# Altium schematic sheet NVME.SchDoc
size C; SheetNumber: 6; SheetTotal: 17
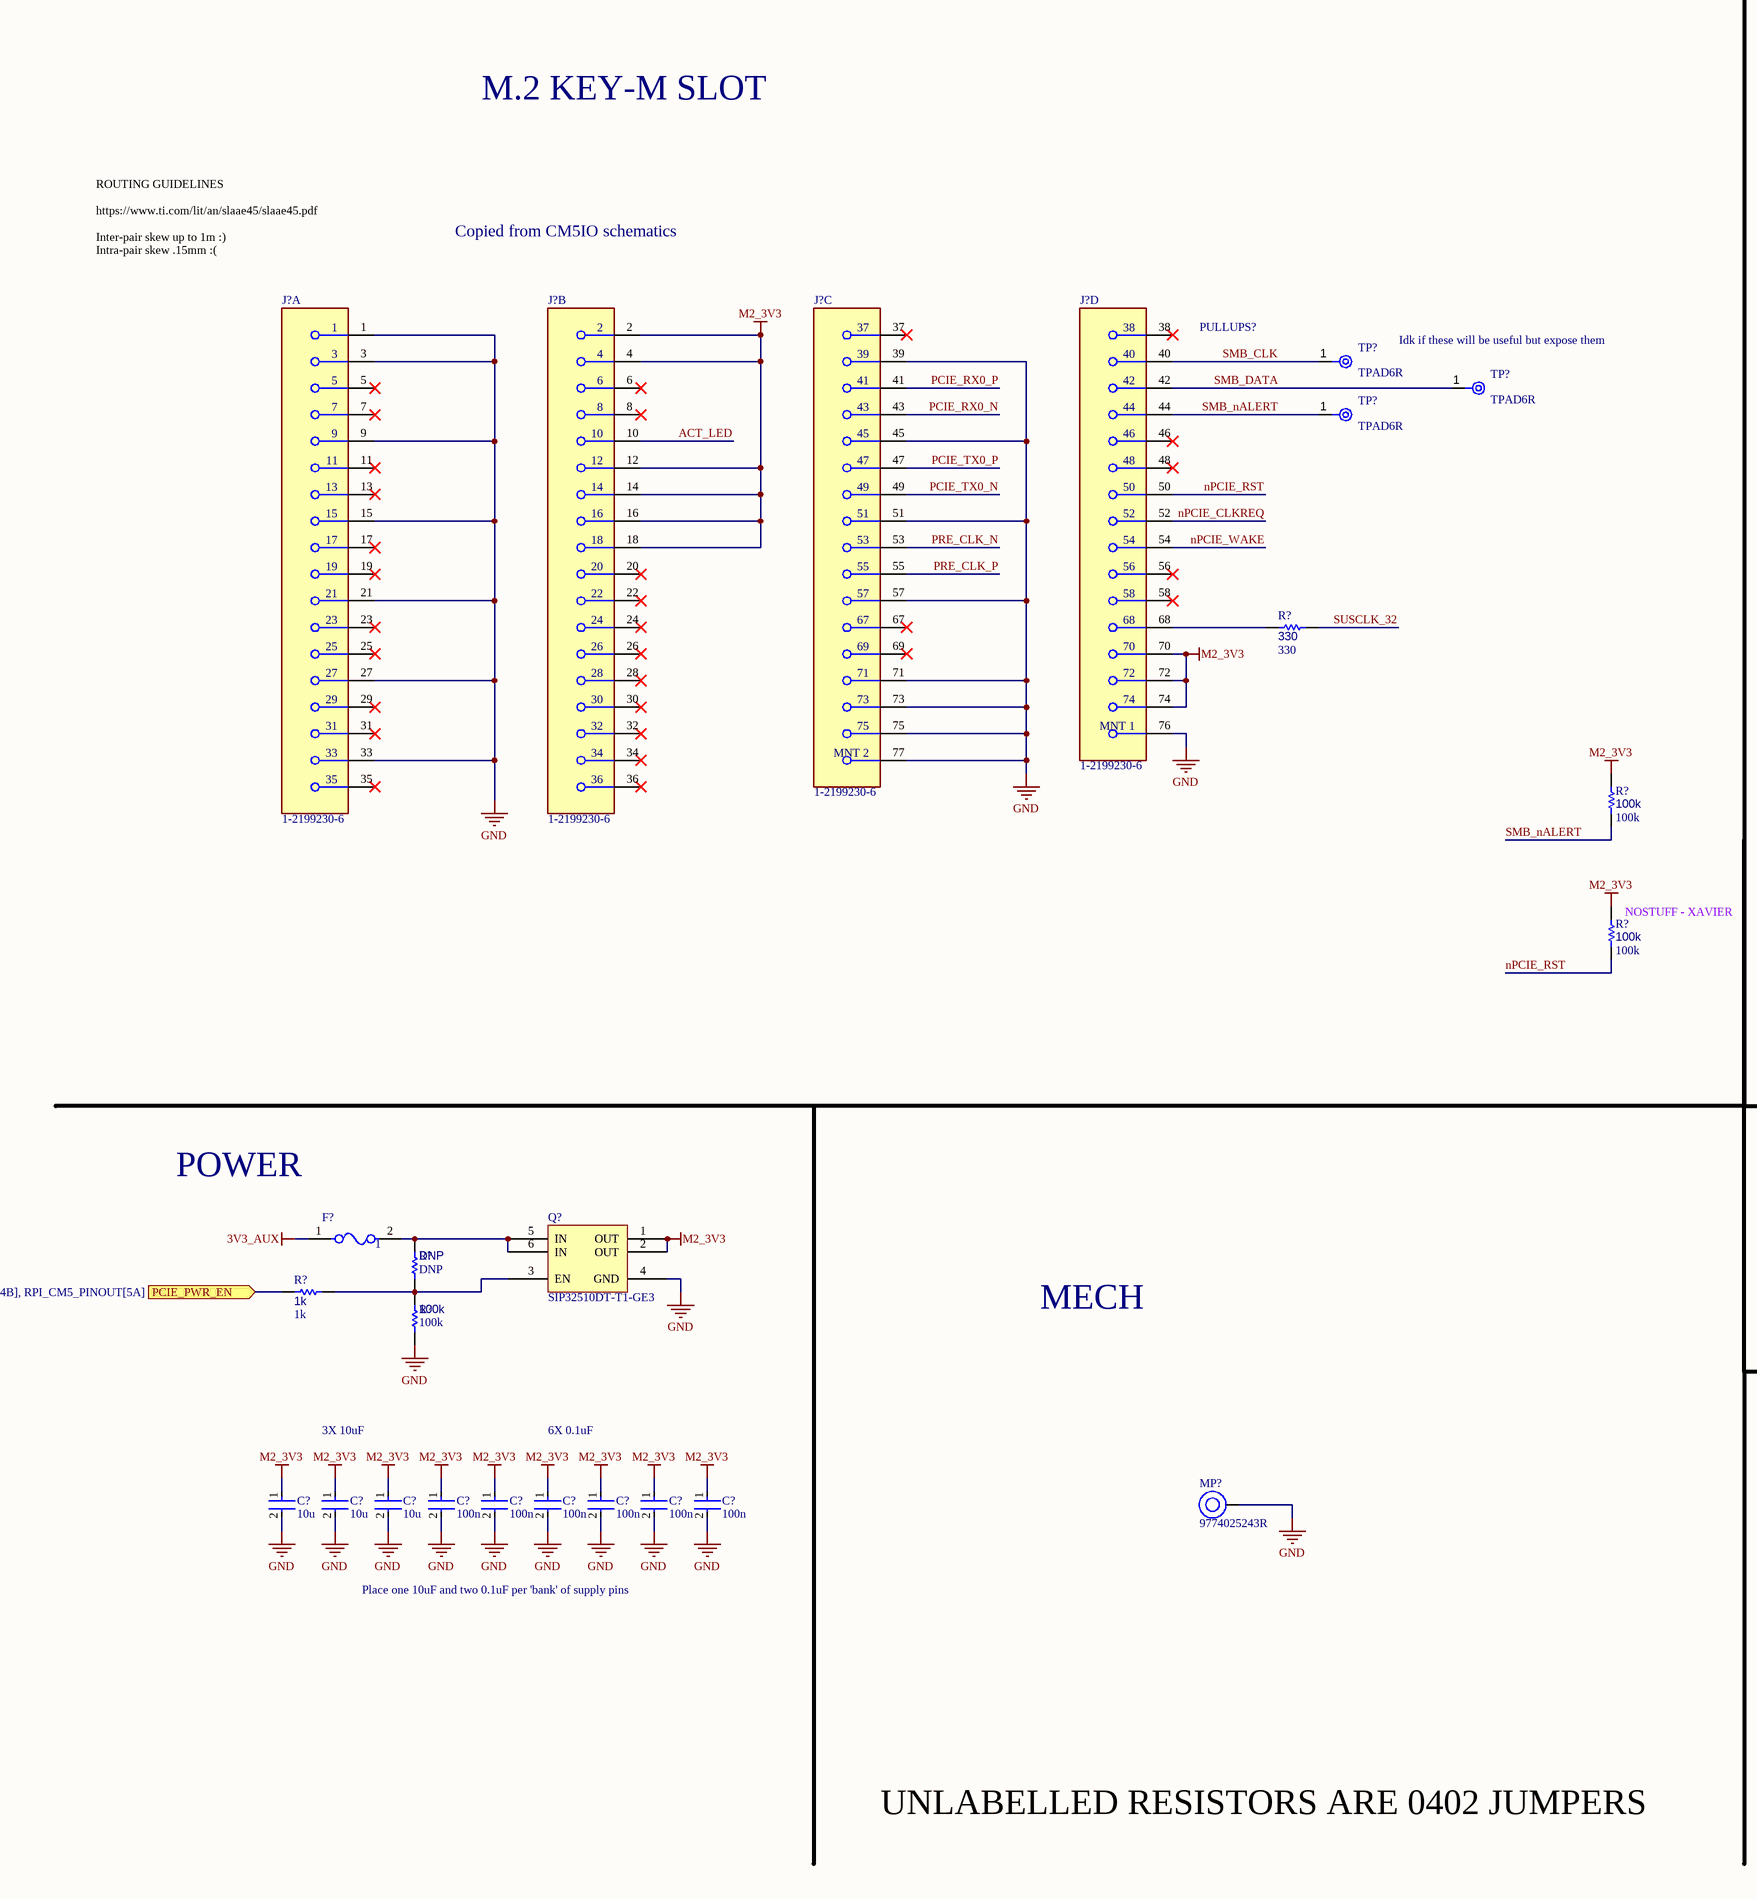
[diagram p0: NVME.SchDoc, left]
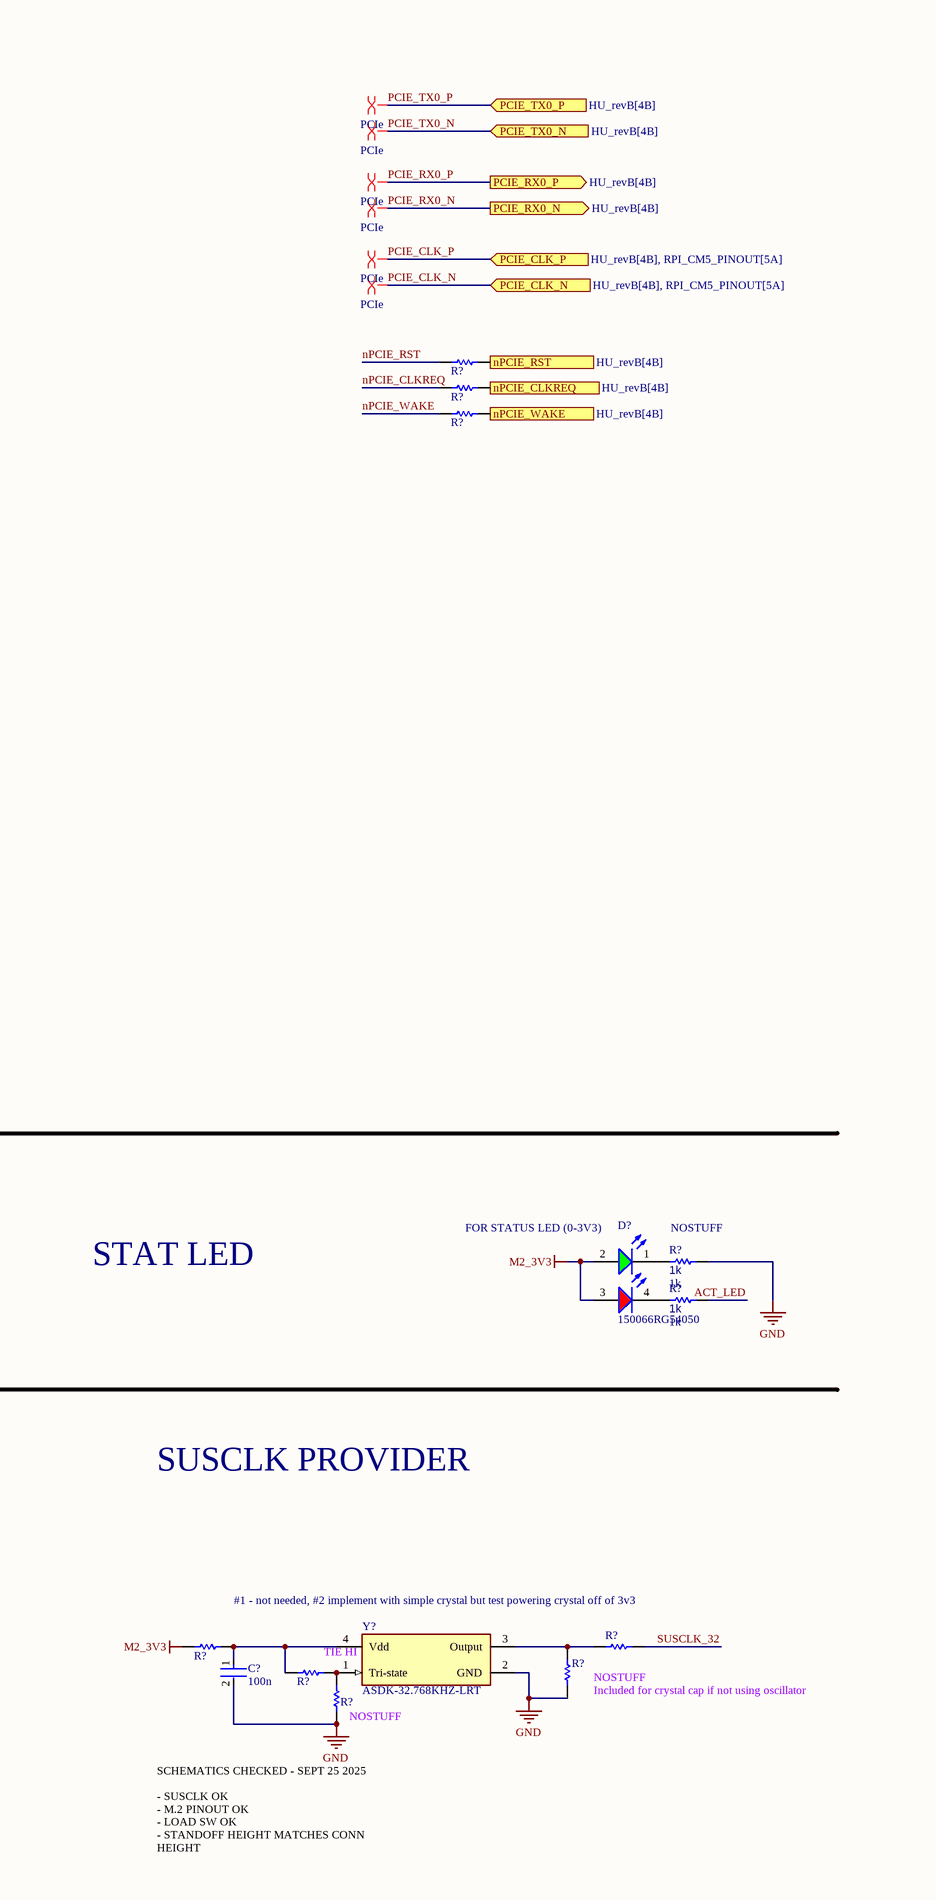
[diagram p1: NVME.SchDoc, right]

## Parts
(Parts that share a designator on the sheet are numbered #1, #2 ... from top to bottom, then left to right.)
C?#1  10u  [FP-0402-L_1_0_0_05-W_0_5-IPC_A]
C?#2  10u  [FP-0402-L_1_0_0_05-W_0_5-IPC_A]
C?#3  10u  [FP-0402-L_1_0_0_05-W_0_5-IPC_A]
C?#4  100n  [FP-0402-L_1_0_0_05-W_0_5-IPC_A]
C?#5  100n  [FP-0402-L_1_0_0_05-W_0_5-IPC_A]
C?#6  100n  [FP-0402-L_1_0_0_05-W_0_5-IPC_A]
C?#7  100n  [FP-0402-L_1_0_0_05-W_0_5-IPC_A]
C?#8  100n  [FP-0402-L_1_0_0_05-W_0_5-IPC_A]
C?#9  100n  [FP-0402-L_1_0_0_05-W_0_5-IPC_A]
C?#10  100n  [FP-0402-L_1_0_0_05-W_0_5-IPC_A]
D?  150066RG54050  [WL-SBCD_0606]
F?  1  [FP-0685T-MFG]
J?#1  1-2199230-6  [FP-1-2199230-6-MFG]  (part A of 4)
J?#2  1-2199230-6  [FP-1-2199230-6-MFG]  (part B of 4)
J?#3  1-2199230-6  [FP-1-2199230-6-MFG]  (part C of 4)
J?#4  1-2199230-6  [FP-1-2199230-6-MFG]  (part D of 4)
MP?  9774025243R  [9774025243]
Q?  SIP32510DT-T1-GE3  [SOT95P284X110-6N]
R?#1  0402 JUMPER  [RESC1005X40X25ML05T05]  (value not drawn)
R?#2  0402 JUMPER  [RESC1005X40X25ML05T05]  (value not drawn)
R?#3  0402 JUMPER  [RESC1005X40X25ML05T05]  (value not drawn)
R?#4  330  [R0603B]
R?#5  100k  [R0603B]
R?#6  100k  [R0603B]
R?#7  1k  [R0603B]
R?#8  DNP  [R0603B]
R?#9  1k  [R0603B]
R?#10  1k  [R0603B]
R?#11  100k  [R0603B]
R?#12  0402 JUMPER  [RESC1005X40X25ML05T05]  (value not drawn)
R?#13  0402 JUMPER  [RESC1005X40X25ML05T05]  (value not drawn)
R?#14  0402 JUMPER  [RESC1005X40X25ML05T05]  (value not drawn)
R?#15  0402 JUMPER  [RESC1005X40X25ML05T05]  (value not drawn)
R?#16  0402 JUMPER  [RESC1005X40X25ML05T05]  (value not drawn)
TP?#1  TPAD6R  [New footprint 1]
TP?#2  TPAD6R  [New footprint 1]
TP?#3  TPAD6R  [New footprint 1]
Y?  ASDK-32.768KHZ-LRT  [FP-ASDK-MFG]

## Ports
nPCIE_CLKREQ (out, see HU_revB[4B]), nPCIE_RST (in, see HU_revB[4B]), nPCIE_WAKE (out, see HU_revB[4B]), PCIE_CLK_N (in, see HU_revB[4B], RPI_CM5_PINOUT[5A]), PCIE_CLK_P (in, see HU_revB[4B], RPI_CM5_PINOUT[5A]), PCIE_PWR_EN (in, see HU_revB[4B], RPI_CM5_PINOUT[5A]), PCIE_RX0_N (out, see HU_revB[4B]), PCIE_RX0_P (out, see HU_revB[4B]), PCIE_TX0_N (in, see HU_revB[4B]), PCIE_TX0_P (in, see HU_revB[4B])

## Nets
3V3_AUX: F?.1
GND: C?#1.2 C?#2.2 C?#3.2 C?#4.2 C?#5.2 C?#6.2 C?#7.2 C?#8.2 C?#9.2 C?#10.2 J?#1.1 J?#1.3 J?#1.9 J?#1.15 J?#1.21 J?#1.27 J?#1.33 J?#3.39 J?#3.45 J?#3.51 J?#3.57 J?#3.71 J?#3.73 J?#3.75 J?#3.77(MNT_2) J?#4.76(MNT_1) MP?.1 Q?.4(GND) R?#7.2 R?#11.1 R?#15.1 R?#16.1 Y?.2(GND)
M2_3V3: C?#1.1 C?#2.1 C?#3.1 C?#4.1 C?#5.1 C?#6.1 C?#7.1 C?#8.1 C?#9.1 D?.2(A) D?.3(A) J?#2.2 J?#2.4 J?#2.12 J?#2.14 J?#2.16 J?#2.18 J?#4.70 J?#4.72 J?#4.74 Q?.1(OUT) Q?.2(OUT) R?#5.1 R?#6.1 R?#12.1
ACT_LED: J?#2.10 R?#9.2
nPCIE_CLKREQ: J?#4.52 R?#2.1
nPCIE_CLKREQ: R?#2.2 ; port nPCIE_CLKREQ  [a separate net that carries the same name]
nPCIE_RST: J?#4.50 R?#1.1 R?#6.2
nPCIE_RST: R?#1.2 ; port nPCIE_RST  [a separate net that carries the same name]
nPCIE_WAKE: J?#4.54 R?#3.1
nPCIE_WAKE: R?#3.2 ; port nPCIE_WAKE  [a separate net that carries the same name]
PCIE_CLK_N: port PCIE_CLK_N
PCIE_CLK_P: port PCIE_CLK_P
PCIE_PWR_EN: R?#10.2 ; port PCIE_PWR_EN
PCIE_RX0_N: J?#3.43 ; port PCIE_RX0_N
PCIE_RX0_P: J?#3.41 ; port PCIE_RX0_P
PCIE_TX0_N: J?#3.49 ; port PCIE_TX0_N
PCIE_TX0_P: J?#3.47 ; port PCIE_TX0_P
PRE_CLK_N: J?#3.53
PRE_CLK_P: J?#3.55
SMB_CLK: J?#4.40 TP?#1.1(TP)
SMB_DATA: J?#4.42 TP?#2.1(TP)
SMB_nALERT: J?#4.44 R?#5.2 TP?#3.1(TP)
SUSCLK_32: R?#4.1 R?#14.1
NetC?#10_1: C?#10.1 R?#12.2 R?#13.1 Y?.4(Vdd)
NetD?_1: D?.1(K) R?#7.1
NetD?_4: D?.4(K) R?#9.1
NetF?_2: F?.2 Q?.5(IN) Q?.6(IN) R?#8.2
NetJ?#4_68: J?#4.68 R?#4.2
NetQ?_3: Q?.3(EN) R?#8.1 R?#10.1 R?#11.2
NetR?#13_2: R?#13.2 R?#16.2 Y?.1(Tri-state)
NetR?#14_2: R?#14.2 R?#15.2 Y?.3(Output)

Not connected (* = marked no-connect by the designer): J?#1 5* 7* 11* 13* 17* 19* 23* 25* 29* 31* 35*; J?#2 6* 8* 20* 22* 24* 26* 28* 30* 32* 34* 36*; J?#3 37* 67* 69*; J?#4 38* 46* 48* 56* 58*

## Layout directives
differential pair; differential pair class PCIe: PCIE_CLK_N, PCIE_CLK_P, PCIE_RX0_N, PCIE_RX0_P, PCIE_TX0_N, PCIE_TX0_P

## Notes on the sheet
- M.2 KEY-M SLOT
- ROUTING GUIDELINES
  https://www.ti.com/lit/an/slaae45/slaae45.pdf
  Inter-pair skew up to 1m :)
  Intra-pair skew .15mm :(
- Copied from CM5IO schematics
- PULLUPS?
- (near TP?#2) Idk if these will be useful but expose them
- (near R?#6) NOSTUFF - XAVIER
- POWER
- STAT LED
- (near D?) FOR STATUS LED (0-3V3)
- (near R?#7) NOSTUFF
- MECH
- 3X 10uF
- 6X 0.1uF
- SUSCLK PROVIDER
- Place one 10uF and two 0.1uF per 'bank' of supply pins
- #1 - not needed, #2 implement with simple crystal but test powering crystal off of 3v3
- (near Y?) TIE HI
- (near R?#16) NOSTUFF
- (near R?#15) NOSTUFF
- (near R?#15) Included for crystal cap if not using oscillator
- UNLABELLED RESISTORS ARE 0402 JUMPERS
- SCHEMATICS CHECKED - SEPT 25 2025
  - SUSCLK OK
  - M.2 PINOUT OK
  - LOAD SW OK
  - STANDOFF HEIGHT MATCHES CONN HEIGHT

## Library data of the parts
C?#1-C?#10 = CMP-001-00058-1: LARGE PADS, 0402 CAP, CHANGE COMMENT TO MATCH REAL P/N; Capacitor Type: Ceramic; Min Operating Temperature: -55°C; Mounting Technology: Surface Mount; Pins: 2; Case/Package: 0402; RoHS Compliant: Yes; Max Operating Temperature: 85°C
D? = CMP-004-00040-2: Led, Red/Grn, 180Mcd/230Mcd, 624Nm/525Nm Rohs Compliant: Yes; Source: rgled.SchLib; Component Type: Standard; Pins: 4; Design Item ID: CMP-004-00034-2
F? = CMP-16042-000006-1: FUSE BOARD MNT 5A 63VAC/VDC 1206; RoHS Compliant: Yes
J?#1-J?#4 = CMP-03365-000001-1: CONN EDGE DUAL FMALE 67POS 0.020; Manufacturer: TE; Number Of Contacts: 67; Current Rating: 0.5A; Pitch: 0.5mm; Conn Gender: Female; Is Female: yes; Voltage Rating: 50V; Conn Orientation: Right Angle; Automotive: No; Temperature Range High: +80°C; Package: 1-2199230-6; Category: Conn; Temperature: -40°C to +80°C; Number Of Rows: 2; ComponentLink2URL: http://www.te.com/commerce/DocumentDelivery/DDEController?Action=showdoc&DocId=Specification+Or+Standard%7F114-115006%7FB%7Fpdf%7FEnglish%7FENG_SS_114-115006_B_114-115006_REV_B.pdf%7F1-2199230-6; Manufacturer Part Number: 1-2199230-6; Height: 4.2mm; RoHS: TRUE; Footprint Url: http://www.te.com/commerce/DocumentDelivery/DDEController?Action=showdoc&DocId=Customer+Drawing%7F2199230%7FB2%7Fpdf%7FEnglish%7FENG_CD_2199230_B2.pdf%7F1-2199230-6; Digikey Description: CONN EDGE DUAL FMALE 67POS 0.020; Device Class L2: Card Edge Connectors; Contact Material: Gold,Tin; Device Class L1: Connectors; Device Class L3: unset; ComponentLink2Description: Datasheet; Temperature Range Low: -40°C; Octopart: https://octopart.com/1-2199230-6-te+connectivity-34969376; Lead Free: Yes
MP? = CMP-03913-59774857-1: 9774025243R Spacer Material: Steel, Tin-Plated Mounting: SMT Series: WA-SMST Thread D: M2; Outside Diameter: 4.3434mm; Threaded/Unthreaded: Threaded; Plating: Tin; REACH SVHC: Unknown; NexarPartId: 59774857; RoHS: Compliant; Material: Steel; Packaging: Tape and Reel; Max Operating Temperature: 150°C; Min Operating Temperature: -55°C; Length: 2.5mm; Height: 2.5mm
Q? = CMP-019-00054-1: Power Switch ICs – Power Distribution; VISHAY; SIP32510DT-T1-GE3; 1; 1; 5.5 V; SOT-23-6; Max Supply Voltage: 5.5V; Max Power Dissipation: 833mW; Min Supply Voltage: 1.2V; Case/Package: SOT-23-6; Mounting Technology: Surface Mount; Max Operating Temperature: 85°C; Min Operating Temperature: -40°C
R?#1-R?#3 R?#12-R?#16 = CMP-009-00118-2: READ THE NAME; Pins: 2; Component Type: Standard; Design Item ID: CMP-009-00206-2; Source: 0402jump.SchLib
R?#4-R?#11 = CMP-009-00002-14: Resistor
  R?#4: Value: 330
  R?#5 R?#6 R?#11: Value: 100k
  R?#7 R?#9 R?#10: Value: 1k
  R?#8: Value: DNP
TP?#1-TP?#3 = CMP-00025-2: Test Point .6mm
Y? = CMP-27762-001115-1: XTAL OSC XO 32.7680KHZ CMOS SMD; Load Capacitance: 15pF; Max Supply Current: 3.5mA; Min Supply Voltage: 2.97V; Operating Supply Voltage: 3.3V; Frequency Stability: 25ppm; Lead Free: Lead Free; Case/Package: CSMD; Number of Pins: 4; Max Operating Temperature: 85°C; Packaging: Tape and Reel; Width: 0.079inch; Min Operating Temperature: -40°C; Radiation Hardening: No; Length: 2.5mm; Depth: 2mm; Termination: SMD/SMT; Height: 0.037inch; Series: ASDK; Frequency: 32.768kHz; Mount: Surface Mount